# EAGLE design brushless_sub_driver_4 (EAGLE 9.6.2)
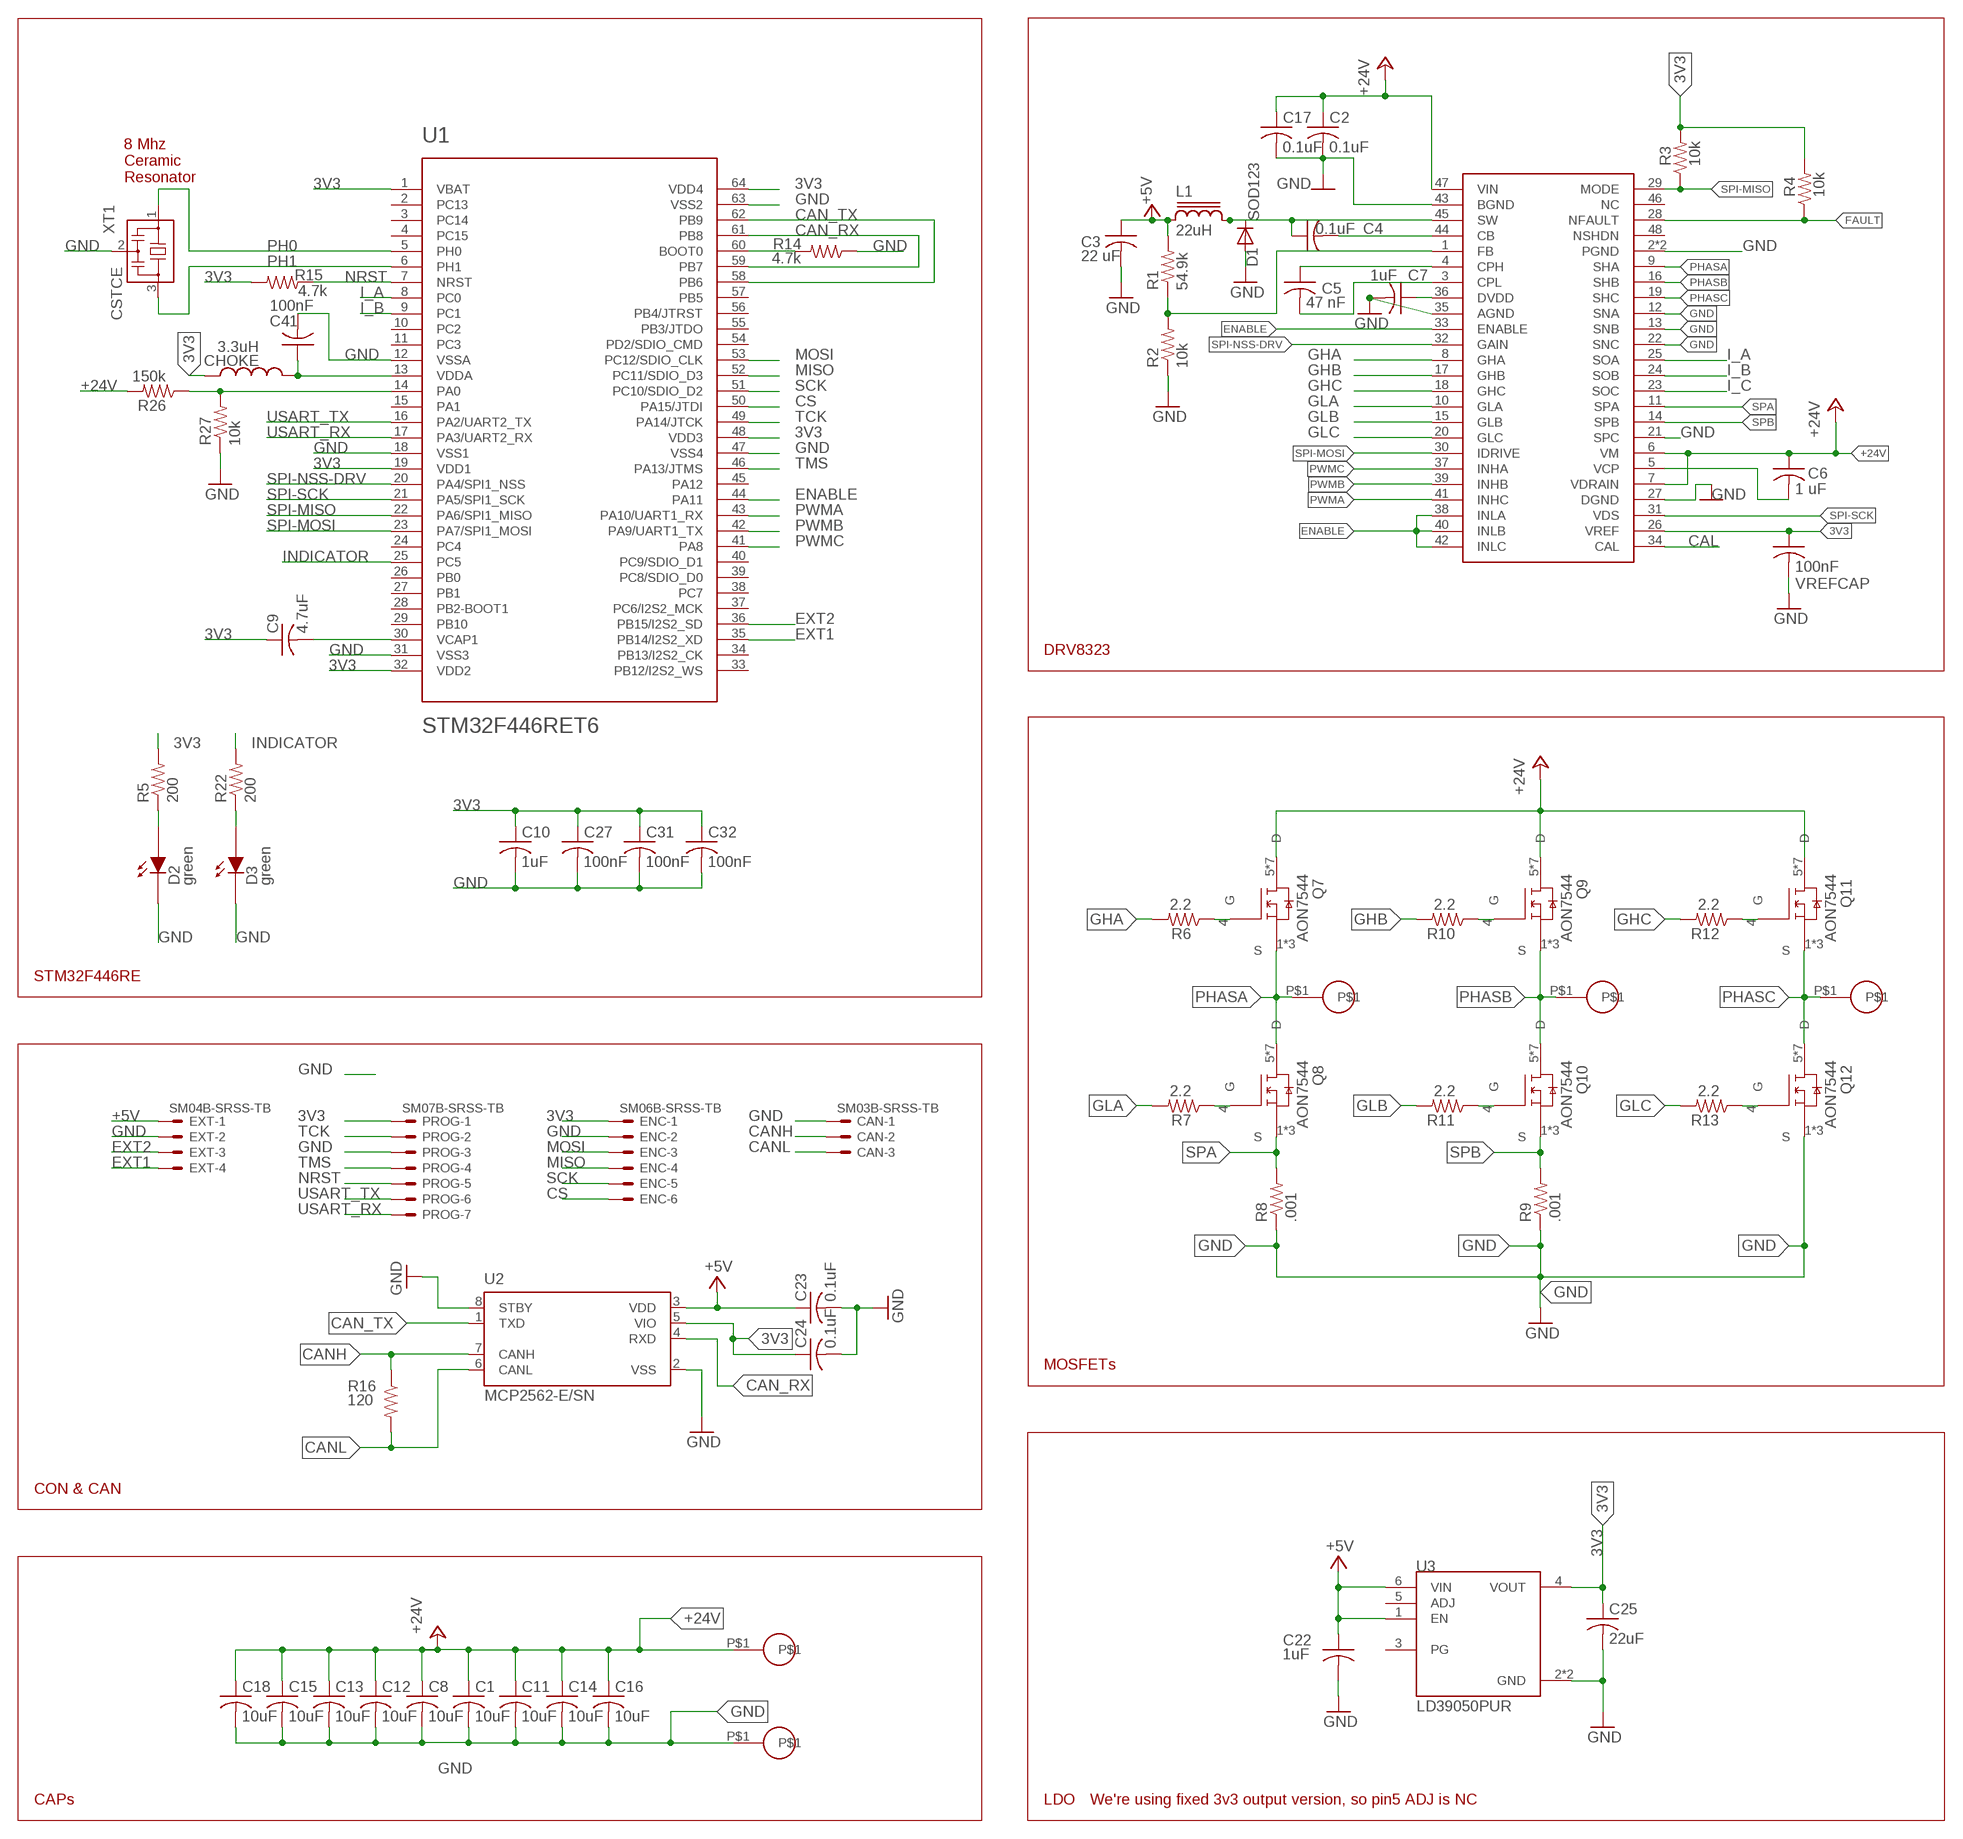
[diagram p0: schematic, sheet 1]

## Parts
C1  10uF  C-USC1206K  [C1206K]
C2  0.1uF  C-USC0603K  [C0603K]
C3  22 uF  C-USC0603K  [C0603K]
C4  0.1uF  C-USC0603K  [C0603K]
C5  47 nF  C-USC0402K  [C0402K]
C6  1 uF  C-USC0603K  [C0603K]
C7  1uF  C-USC0402K  [C0402K]
C8  10uF  C-USC1206K  [C1206K]
C9  4.7uF  C-USC0402K  [C0402K]
C10  1uF  C-USC0402K  [C0402K]
C11  10uF  C-USC1206K  [C1206K]
C12  10uF  C-USC1206K  [C1206K]
C13  10uF  C-USC1206K  [C1206K]
C14  10uF  C-USC1206K  [C1206K]
C15  10uF  C-USC1206K  [C1206K]
C16  10uF  C-USC1206K  [C1206K]
C17  0.1uF  C-USC1206K  [C1206K]
C18  10uF  C-USC1206K  [C1206K]
C22  1uF  C-USC0402  [C0402]
C23  0.1uF  C-USC0603K  [C0603K]
C24  0.1uF  C-USC0603K  [C0603K]
C25  22uF  C-USC0603K  [C0603K]
C27  100nF  C-USC0402K  [C0402K]
C31  100nF  C-USC0402K  [C0402K]
C32  100nF  C-USC0402K  [C0402K]
C41  100nF  C-USC0402  [C0402]
CAN  SM03B-SRSS-TB  [SM03B-SRSS-TB]
CHOKE  3.3uH  INDUCTOR0603  [0603]
D1  SOD123  DIODE-SOD123  [SOD123]
D2  green  LEDB  [0603P]
D3  green  LEDB  [0603P]
DRV1  DRV8323RH  [QFN50P700X700X90-49N]
ENC  SM06B-SRSS-TB  [SM06B-SRSS-TB]
EXT  SM04B-SRSS-TB  [SM04B-SRSS-TB]
L1  22uH  SDR0302  [SDR0302]
O_A  18_AWG_PAD  [18_AWG_PAD]
O_B  18_AWG_PAD  [18_AWG_PAD]
O_C  18_AWG_PAD  [18_AWG_PAD]
PROG  SM07B-SRSS-TB  [SM07B-SRSS-TB]
Q7  AON7544  [AON7544]
Q8  AON7544  [AON7544]
Q9  AON7544  [AON7544]
Q10  AON7544  [AON7544]
Q11  AON7544  [AON7544]
Q12  AON7544  [AON7544]
R1  54.9k  R-US_R0402  [R0402]
R2  10k  R-US_R0402  [R0402]
R3  10k  R-US_R0402  [R0402]
R4  10k  R-US_R0402  [R0402]
R5  200  R-US_R0402  [R0402]
R6  2.2  R-US_R0402  [R0402]
R7  2.2  R-US_R0402  [R0402]
R8  .001  R-US_R1210  [R1210]
R9  .001  R-US_R1210  [R1210]
R10  2.2  R-US_R0402  [R0402]
R11  2.2  R-US_R0402  [R0402]
R12  2.2  R-US_R0402  [R0402]
R13  2.2  R-US_R0402  [R0402]
R14  4.7k  R-US_R0402  [R0402]
R15  4.7k  R-US_R0402  [R0402]
R16  120  R-US_R0603  [R0603]
R22  200  R-US_R0402  [R0402]
R26  150k  R-US_R0402  [R0402]
R27  10k  R-US_R0402  [R0402]
U1  STM32F446RET6  [TQFP64]
U2  MCP2562-E/SN  [SOIC127P600X175-8N]
U3  LD39050PUR  [SON95P300X300X100-7N]
U$8  18_AWG_PAD  [18_AWG_PAD]
U$10  18_AWG_PAD  [18_AWG_PAD]
VREFCAP  100nF  C-USC0402K  [C0402K]
XT1  CSTCE  [CSTCE]

## Nets
3V3: C9.1 C10.1 C24.1 C25.1 C27.1 C31.1 C32.1 CHOKE.1 DRV1.26(VREF) ENC.1 PROG.1 R3.2 R4.2 R5.2 R15.2 U1.1(VBAT) U1.19(VDD1) U1.32(VDD2) U1.48(VDD3) U1.64(VDD4) U2.5(VIO) U3.4(VOUT) VREFCAP.1
+5V: C3.1 C22.1 C23.1 EXT.1 L1.1 R1.2 U2.3(VDD) U3.1(EN) U3.6(VIN)
+24V: C1.1 C2.1 C6.1 C8.1 C11.1 C12.1 C13.1 C14.1 C15.1 C16.1 C17.1 C18.1 DRV1.6(VM) DRV1.7(VDRAIN) DRV1.47(VIN) Q7.5(D) Q7.6(D) Q7.7(D) Q7.8(D) Q7.9(D) Q7.10(D) Q7.11(D) Q9.5(D) Q9.6(D) Q9.7(D) Q9.8(D) Q9.9(D) Q9.10(D) Q9.11(D) Q11.5(D) Q11.6(D) Q11.7(D) Q11.8(D) Q11.9(D) Q11.10(D) Q11.11(D) R26.2 U$8.P$1
BOOT: C4.2 DRV1.44(CB)
CAL: DRV1.34(CAL)
CAN_RX: U1.59(PB7) U1.61(PB8) U2.4(RXD)
CAN_TX: U1.58(PB6) U1.62(PB9) U2.1(TXD)
CANH: CAN.2 R16.1 U2.7(CANH)
CANL: CAN.3 R16.2 U2.6(CANL)
CPH: C5.1 DRV1.4(CPH)
CPL: C5.2 DRV1.3(CPL)
CS: ENC.6 U1.50(PA15/JTDI)
DEVICE3.3: C7.1 DRV1.36(DVDD)
ENABLE: DRV1.33(ENABLE) DRV1.38(INLA) DRV1.40(INLB) DRV1.42(INLC) U1.44(PA11)
EXT1: EXT.4 U1.35(PB14/I2S2_XD)
EXT2: EXT.3 U1.36(PB15/I2S2_SD)
FAULT: DRV1.28(NFAULT) R4.1
FB: DRV1.1(FB) R1.1 R2.2
GHA: DRV1.8(GHA) R6.2
GHB: DRV1.17(GHB) R10.2
GHC: DRV1.18(GHC) R12.2
GLA: DRV1.10(GLA) R7.2
GLB: DRV1.15(GLB) R11.2
GLC: DRV1.20(GLC) R13.2
GND: C1.2 C2.2 C3.2 C7.2 C8.2 C10.2 C11.2 C12.2 C13.2 C14.2 C15.2 C16.2 C17.2 C18.2 C22.2 C23.2 C24.2 C25.2 C27.2 C31.2 C32.2 C41.2 CAN.1 D1.A D2.2(D_OUT) D3.2(D_OUT) DRV1.2(PGND) DRV1.12(SNA) DRV1.13(SNB) DRV1.21(SPC) DRV1.22(SNC) DRV1.27(DGND) DRV1.35(AGND) DRV1.43(BGND) DRV1.49(PGND) ENC.2 EXT.2 PROG.3 Q12.1(S) Q12.2(S) Q12.3(S) R2.1 R8.1 R9.1 R14.1 R27.1 U1.12(VSSA) U1.18(VSS1) U1.31(VSS3) U1.47(VSS4) U1.63(VSS2) U2.2(VSS) U2.8(STBY) U3.2(GND) U3.7(GND) U$10.P$1 VREFCAP.2 XT1.2
I_A: DRV1.25(SOA) U1.8(PC0)
I_B: DRV1.24(SOB) U1.9(PC1)
I_C: DRV1.23(SOC)
INDICATOR: R22.2 U1.25(PC5)
MISO: ENC.4 U1.52(PC11/SDIO_D3)
MOSI: ENC.3 U1.53(PC12/SDIO_CLK)
N$1: D2.1(D_IN) R5.1
N$2: C41.1 CHOKE.2 U1.13(VDDA)
N$3: C9.2 U1.30(VCAP1)
N$5: Q7.4(G) R6.1
N$7: Q8.4(G) R7.1
N$8: Q9.4(G) R10.1
N$10: Q10.4(G) R11.1
N$11: Q11.4(G) R12.1
N$12: Q12.4(G) R13.1
N$14: R14.2 U1.60(BOOT0)
N$24: R26.1 R27.2 U1.14(PA0)
N$28: D3.1(D_IN) R22.1
NRST: PROG.5 R15.1 U1.7(NRST)
PH0: U1.5(PH0) XT1.1
PH1: U1.6(PH1) XT1.3
PHASA: DRV1.9(SHA) O_A.P$1 Q7.1(S) Q7.2(S) Q7.3(S) Q8.5(D) Q8.6(D) Q8.7(D) Q8.8(D) Q8.9(D) Q8.10(D) Q8.11(D)
PHASB: DRV1.16(SHB) O_B.P$1 Q9.1(S) Q9.2(S) Q9.3(S) Q10.5(D) Q10.6(D) Q10.7(D) Q10.8(D) Q10.9(D) Q10.10(D) Q10.11(D)
PHASC: DRV1.19(SHC) O_C.P$1 Q11.1(S) Q11.2(S) Q11.3(S) Q12.5(D) Q12.6(D) Q12.7(D) Q12.8(D) Q12.9(D) Q12.10(D) Q12.11(D)
PWMA: DRV1.41(INHC) U1.43(PA10/UART1_RX)
PWMB: DRV1.39(INHB) U1.42(PA9/UART1_TX)
PWMC: DRV1.37(INHA) U1.41(PA8)
SCK: ENC.5 U1.51(PC10/SDIO_D2)
SPA: DRV1.11(SPA) Q8.1(S) Q8.2(S) Q8.3(S) R8.2
SPB: DRV1.14(SPB) Q10.1(S) Q10.2(S) Q10.3(S) R9.2
SPI-MISO: DRV1.29(MODE) R3.1 U1.22(PA6/SPI1_MISO)
SPI-MOSI: DRV1.30(IDRIVE) U1.23(PA7/SPI1_MOSI)
SPI-NSS-DRV: DRV1.32(GAIN) U1.20(PA4/SPI1_NSS)
SPI-SCK: DRV1.31(VDS) U1.21(PA5/SPI1_SCK)
SW: C4.1 D1.C DRV1.45(SW) L1.2
TCK: PROG.2 U1.49(PA14/JTCK)
TMS: PROG.4 U1.46(PA13/JTMS)
USART_RX: PROG.7 U1.17(PA3/UART2_RX)
USART_TX: PROG.6 U1.16(PA2/UART2_TX)
VCP: C6.2 DRV1.5(VCP)
Unconnected: DRV1.46(NC) DRV1.48(NSHDN) U1.2(PC13) U1.3(PC14) U1.4(PC15) U1.10(PC2) U1.11(PC3) U1.15(PA1) U1.24(PC4) U1.26(PB0) U1.27(PB1) U1.28(PB2-BOOT1) U1.29(PB10) U1.33(PB12/I2S2_WS) U1.34(PB13/I2S2_CK) U1.37(PC6/I2S2_MCK) U1.38(PC7) U1.39(PC8/SDIO_D0) U1.40(PC9/SDIO_D1) U1.45(PA12) U1.54(PD2/SDIO_CMD) U1.55(PB3/JTDO) U1.56(PB4/JTRST) U1.57(PB5) U3.3(PG) U3.5(ADJ)

## Notes on the sheet
- 8 Mhz
  Ceramic
  Resonator
- DRV8323
- STM32F446RE
- MOSFETs
- CON & CAN
- CAPs | LDO | We're using fixed 3v3 output version, so pin5 ADJ is NC

## Library data of the parts
C1-C18 C22-C25 C27 C31 C32 C41 VREFCAP = rcl:C-US: CAPACITOR, American symbol
CAN = con-jst2:?M03B-SRSS-TB: Disconnectable Crimp style connector, 1.0mm pitch 3 contacts
CHOKE = SparkFun-Passives:INDUCTOR: Inductors Basic Inductor/Choke - 0603 and 1206. Footprints are not proven and vary greatly between part numbers. INDUCTOR POWER 3.3UH 4.0A SMD 0.197" L x 0.197" W x 0.177" H (5.00mm x 5.00mm x 4.50mm)
D1 = diode:DIODE-: DIODE
D2 D3 = m-pad-2.1:LED: LED's in various packages
DRV1 = BenLibrary:DRV8323RH
ENC = con-jst2:?M06B-SRSS-TB: Disconnectable Crimp style connector, 1.0mm pitch 6 contacts
EXT = con-jst2:?M04B-SRSS-TB: Disconnectable Crimp style connector, 1.0mm pitch 4 contacts
L1 = inductor-bourns:SDR0302: POWER INDUCTOR
O_A O_B O_C U$8 U$10 = BenLibrary:18_AWG_PAD
PROG = con-jst2:?M07B-SRSS-TB: Disconnectable Crimp style connector, 1.0mm pitch 7 contacts
Q7-Q12 = AON7544:AON7544: MOSFET N Trench 30V 30A(Tc) 2.2V @ 250uA 5 m @ 20A,10V DFN-8_3x3 EP RoHS Source: Datasheet <https://datasheet.lcsc.com/lcsc/1912111437_Alpha---Omega-Semicon-AON7544_C315567.pdf>; DESCRIPTION: MOSFET N Trench 30V 30A(Tc) 2.2V @ 250uA 5 m @ 20A,10V DFN-8_3x3 EP RoHS; HEIGHT: 0.9mm; MANUFACTURER_NAME: Alpha & Omega Semiconductors; MANUFACTURER_PART_NUMBER: AON7544
R1-R16 R22 R26 R27 = rcl:R-US_: RESISTOR, American symbol
U1 = BenLibrary:STM32F446RET6: ARM DSP Chip used on the WAV Trigger board.
U2 = MCP2562-E_SN:MCP2562-E/SN: MCP2562 Series 5 V Surface Mount High-Speed CAN Transceiver - SOIC-8 Check availability <https://pricing.snapeda.com/parts/MCP2562-E/SN/Microchip/view-part?ref=eda>; AVAILABILITY: In Stock; DESCRIPTION: 1/1 Transceiver Half CANbus 8-SOIC; MF: Microchip; MP: MCP2562-E/SN; PACKAGE: SO-8 Microchip; PRICE: None; PURCHASE-URL: https://pricing.snapeda.com/search/part/MCP2562-E/SN/?ref=eda
U3 = LD39050PUR:LD39050PUR: LD39050 Series Adj to 0.8 V 500 mA Low Noise Voltage Regulator - SOT-23-5 Check availability <https://pricing.snapeda.com/parts/LD39050PUR/STMicroelectronics/view-part?ref=eda>; AVAILABILITY: In Stock; DESCRIPTION: Linear Voltage Regulator IC Positive Adjustable 1 Output 500mA 6-DFN (3x3); MF: STMicroelectronics; MP: LD39050PUR; PACKAGE: DFN-6 STMicroelectronics; PRICE: None; PURCHASE-URL: https://pricing.snapeda.com/search/part/LD39050PUR/?ref=eda
XT1 = sc_usercreated:CSTCE

## Board
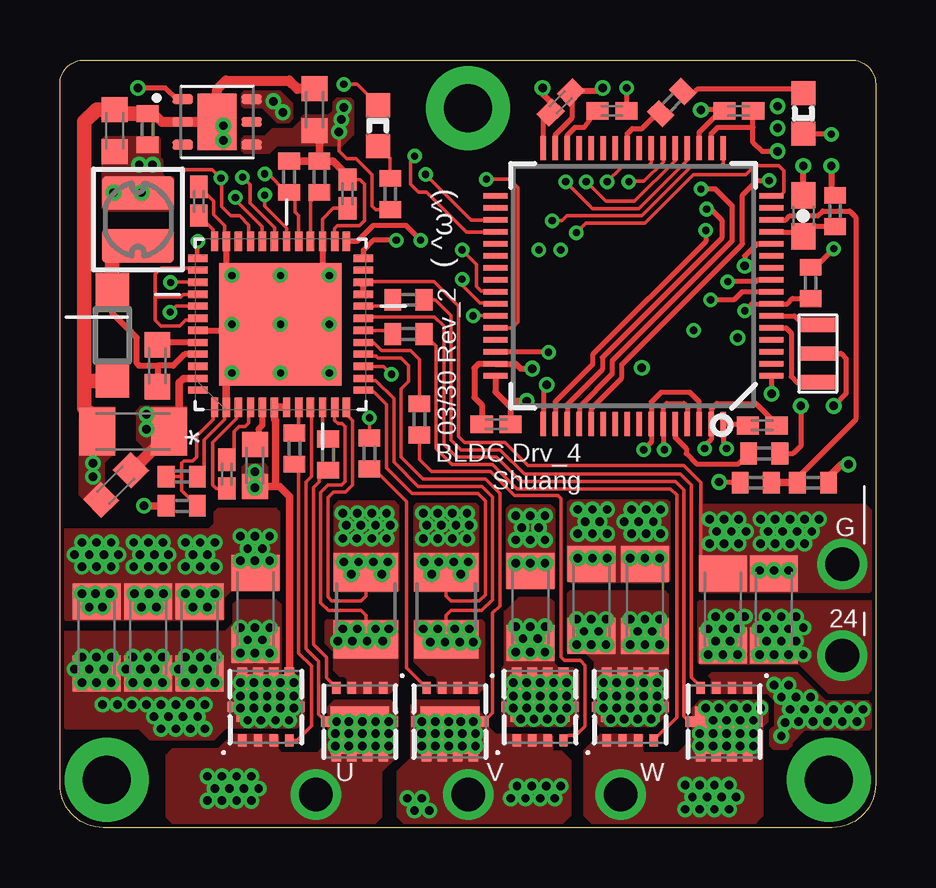
[diagram p1: board, top side]
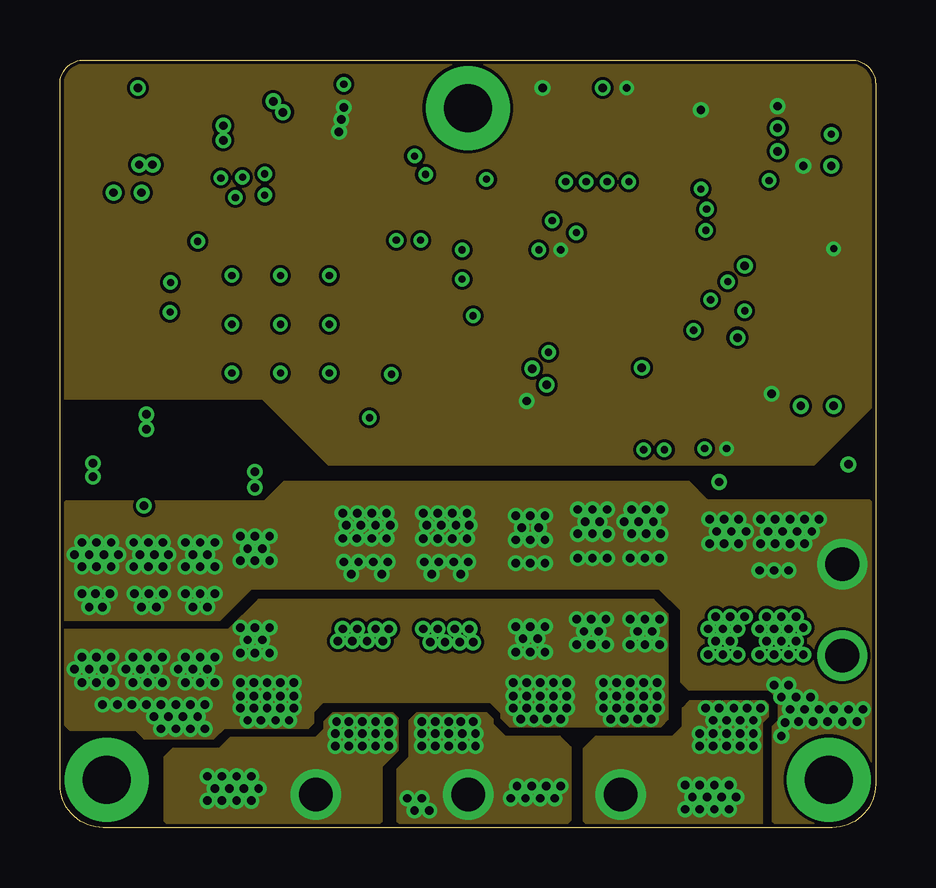
[diagram p2: board, inner layer Route2]
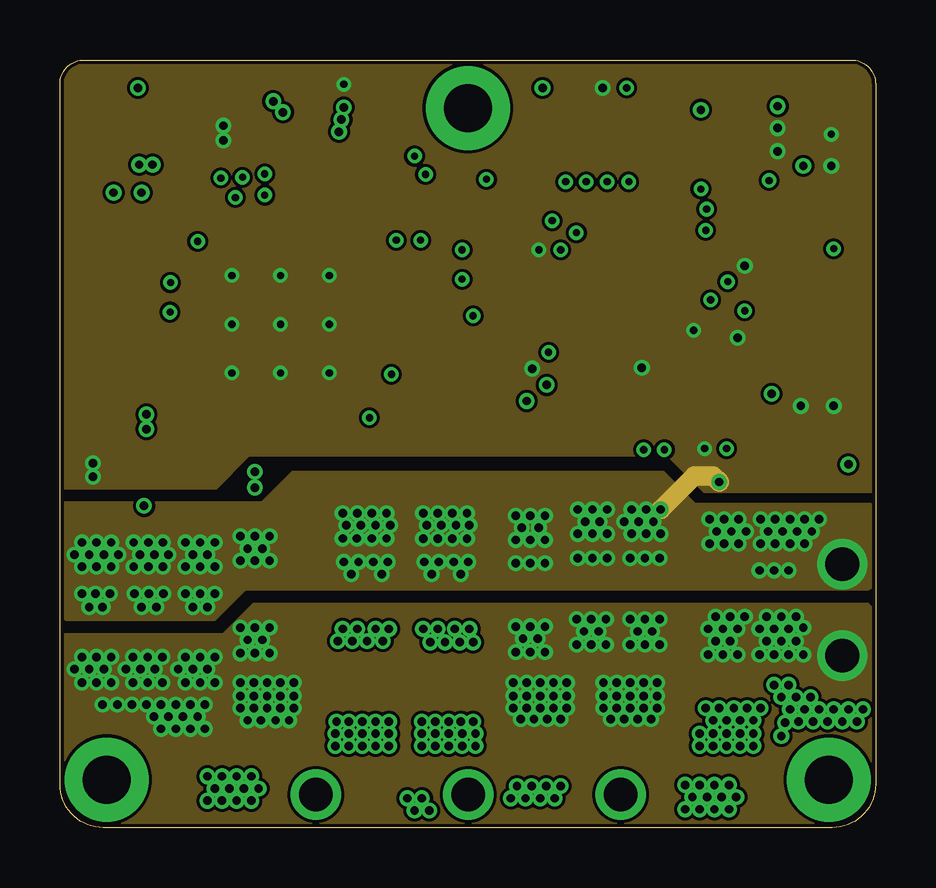
[diagram p3: board, inner layer Route15]
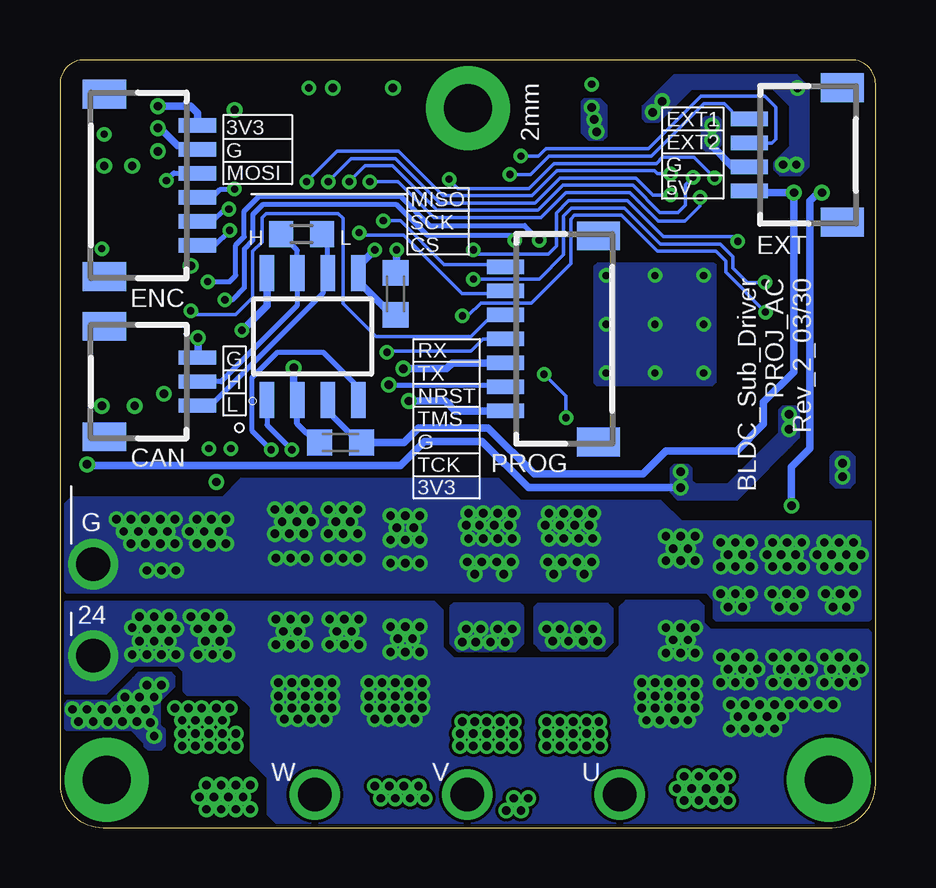
[diagram p4: board, bottom side, seen from below]

Size 34 x 32 mm. Coordinates in mm from the lower left corner, seen from the top.
Outline: 1,32 33,32 arc-90 34,31 34,1.8 arc-90 32.2,0 1.8,0 arc-90 0,1.8 0,31 arc-90 1,32
Copper layers (1+2*15+16): Top 0.035mm / dielectric 1.5mm / Route2 0.035mm / dielectric 0.15mm / Route15 0.035mm / dielectric 0.2mm / Bottom 0.035mm
Design rules "shuang_4layer_jlc_t1 *": minimum track width 5mil, minimum drill 0.3mm, track to track 5mil, track to pad 5mil, pad to pad 5mil, via to via 6mil, smd to smd 5mil, copper to edge 6mil, drill to drill 6mil, minimum pad ring 10mil, minimum via ring 6mil, stop-mask expansion 4mil, vias tented up to drill 14mil, thermal gap 10mil

### Footprints (pad centres in the part's own frame; a part is rotated, then mirrored left to right if it is on the bottom)
C1206K = smd 1.5 x 2: 1 -1.5,0; 2 1.5,0
C0603K = smd 1.05 x 1.08: 1 -0.875,0; 2 0.875,0
C0402K = smd 0.925 x 0.74: 1 -0.6,0; 2 0.6,0
C0402 = smd 0.7 x 0.9: 1 -0.65,0; 2 0.65,0
SM03B-SRSS-TB = smd 0.6 x 1.55: 1 -1,2.975; 2 0,2.975; 3 1,2.975 | smd 1.2 x 1.8: FIT@1 -2.3,-0.9; FIT@2 2.3,-0.9
0603 = smd 1.1 x 1: 1 -0.85,0; 2 0.85,0
SOD123 = smd 1.4 x 1.4: A 1.9,0; C -1.9,0
0603P = smd 1 x 1: 1 -0.85,0; 2 0.85,0
QFN50P700X700X90-49N = smd 0.813 x 0.305: 1 -3.454,2.743; 2 -3.454,2.261; 3 -3.454,1.753; 4 -3.454,1.245; 5 -3.454,0.762; 6 -3.454,0.254; 7 -3.454,-0.254; 8 -3.454,-0.762; 9 -3.454,-1.245; 10 -3.454,-1.753; 11 -3.454,-2.261; 12 -3.454,-2.743; 25 3.454,-2.743; 26 3.454,-2.261; 27 3.454,-1.753; 28 3.454,-1.245; 29 3.454,-0.762; 30 3.454,-0.254; 31 3.454,0.254; 32 3.454,0.762; 33 3.454,1.245; 34 3.454,1.753; 35 3.454,2.261; 36 3.454,2.743 | smd 0.305 x 0.813: 13 -2.743,-3.454; 14 -2.261,-3.454; 15 -1.753,-3.454; 16 -1.245,-3.454; 17 -0.762,-3.454; 18 -0.254,-3.454; 19 0.254,-3.454; 20 0.762,-3.454; 21 1.245,-3.454; 22 1.753,-3.454; 23 2.261,-3.454; 24 2.743,-3.454; 37 2.743,3.454; 38 2.261,3.454; 39 1.753,3.454; 40 1.245,3.454; 41 0.762,3.454; 42 0.254,3.454; 43 -0.254,3.454; 44 -0.762,3.454; 45 -1.245,3.454; 46 -1.753,3.454; 47 -2.261,3.454; 48 -2.743,3.454 | smd 5.105 x 5.105: 49 0,0
SM06B-SRSS-TB = smd 0.6 x 1.55: 1 -2.5,2.975; 2 -1.5,2.975; 3 -0.5,2.975; 4 0.5,2.975; 5 1.5,2.975; 6 2.5,2.975 | smd 1.2 x 1.8: FIT@1 -3.8,-0.9; FIT@2 3.8,-0.9
SM04B-SRSS-TB = smd 0.6 x 1.55: 1 -1.5,2.975; 2 -0.5,2.975; 3 0.5,2.975; 4 1.5,2.975 | smd 1.2 x 1.8: FIT@1 -2.8,-0.9; FIT@2 2.8,-0.9
SDR0302 = smd 3 x 1.4: 1 0,1.1; 2 0,-1.1
18_AWG_PAD = drill 1.4: P$1 0,0
SM07B-SRSS-TB = smd 0.6 x 1.55: 1 -3,2.975; 2 -2,2.975; 3 -1,2.975; 4 0,2.975; 5 1,2.975; 6 2,2.975; 7 3,2.975 | smd 1.2 x 1.8: FIT@1 -4.3,-0.9; FIT@2 4.3,-0.9
AON7544 = smd 0.35 x 0.5: 1 -0.975,-1.4; 2 -0.325,-1.4; 3 0.325,-1.4; 4 0.975,-1.4 | smd 0.4 x 0.3: 5 0.975,1.5; 6 0.325,1.5; 7 -0.325,1.5; 8 -0.975,1.5 | smd 0.38 x 0.43: 9 -1.415,0; 11 1.415,0 | smd 2.45 x 1.98: 10 0,0.36
R0402 = smd 0.7 x 0.9: 1 -0.65,0; 2 0.65,0
R1210 = smd 1.6 x 2.7: 1 -1.4,0; 2 1.4,0
R0603 = smd 1 x 1.1: 1 -0.85,0; 2 0.85,0
TQFP64 = smd 0.22 x 1: 1 -3.75,-5.75; 2 -3.25,-5.75; 3 -2.75,-5.75; 4 -2.25,-5.75; 5 -1.75,-5.75; 6 -1.25,-5.75; 7 -0.75,-5.75; 8 -0.25,-5.75; 9 0.25,-5.75; 10 0.75,-5.75; 11 1.25,-5.75; 12 1.75,-5.75; 13 2.25,-5.75; 14 2.75,-5.75; 15 3.25,-5.75; 16 3.75,-5.75; 33 3.75,5.75; 34 3.25,5.75; 35 2.75,5.75; 36 2.25,5.75; 37 1.75,5.75; 38 1.25,5.75; 39 0.75,5.75; 40 0.25,5.75; 41 -0.25,5.75; 42 -0.75,5.75; 43 -1.25,5.75; 44 -1.75,5.75; 45 -2.25,5.75; 46 -2.75,5.75; 47 -3.25,5.75; 48 -3.75,5.75 | smd 1 x 0.22: 17 5.75,-3.75; 18 5.75,-3.25; 19 5.75,-2.75; 20 5.75,-2.25; 21 5.75,-1.75; 22 5.75,-1.25; 23 5.75,-0.75; 24 5.75,-0.25; 25 5.75,0.25; 26 5.75,0.75; 27 5.75,1.25; 28 5.75,1.75; 29 5.75,2.25; 30 5.75,2.75; 31 5.75,3.25; 32 5.75,3.75; 49 -5.75,3.75; 50 -5.75,3.25; 51 -5.75,2.75; 52 -5.75,2.25; 53 -5.75,1.75; 54 -5.75,1.25; 55 -5.75,0.75; 56 -5.75,0.25; 57 -5.75,-0.25; 58 -5.75,-0.75; 59 -5.75,-1.25; 60 -5.75,-1.75; 61 -5.75,-2.25; 62 -5.75,-2.75; 63 -5.75,-3.25; 64 -5.75,-3.75
SOIC127P600X175-8N = smd 1.5 x 0.6: 1 -2.65,1.905; 2 -2.65,0.635; 3 -2.65,-0.635; 4 -2.65,-1.905; 5 2.65,-1.905; 6 2.65,-0.635; 7 2.65,0.635; 8 2.65,1.905
SON95P300X300X100-7N = smd 0.84 x 0.4: 1 -1.435,0.95; 2 -1.435,0; 3 -1.435,-0.95; 4 1.435,-0.95; 5 1.435,0; 6 1.435,0.95 | smd 1.625 x 2.365: 7 0,0
CSTCE = smd 0.6 x 1.6: 1 -1.2,0; 2 0,0; 3 1.2,0

### Placement (x,y rotation side)
C1  3.68,7.92 90 top
C2  2.34,14.27 225 top
C3  2.29,29.06 90 top
C4  4.06,19.25 90 top
C5  6.96,14.73 270 top
C6  8.13,15.09 90 top
C7  5.79,26.11 90 top
C8  5.82,7.92 90 top
C9  23.01,29.87 180 top
C10  29.27,16.76 0 top
C11  8.15,9.12 90 top
C12  1.52,7.92 90 top
C13  27.64,9.09 90 top
C14  24.38,9.5 90 top
C15  22.15,9.5 90 top
C16  19.61,9.19 90 top
C17  3.05,16.51 180 top
C18  29.77,9.09 90 top
C22  3.66,29.11 90 top
C23  22.3,16.05 180 bottom
C24  20.02,22.25 90 bottom
C25  10.62,29.92 90 top
C27  28.3,29.87 0 top
C31  18.19,16.81 180 top
C32  20.88,30.23 45 top
C41  32.31,25.7 90 top
CAN  31.24,18.59 270 bottom
CHOKE  30.99,25.5 270 top
D1  2.18,20.52 270 top
D2  13.26,29.26 90 top
D3  30.99,29.77 270 top
DRV1  9.19,20.98 90 top
ENC  31.24,26.77 270 bottom
EXT  2.29,28.04 90 bottom
L1  3.25,25.35 0 top
O_A  10.67,1.37 0 top
O_B  17.02,1.37 0 top
O_C  23.37,1.37 0 top
PROG  12.45,20.37 90 bottom
Q7  8.59,5.03 0 top
Q8  12.5,4.42 180 top
Q9  20.02,5.03 0 top
Q10  16.26,4.42 180 top
Q11  23.77,5.03 0 top
Q12  27.69,4.42 180 top
R1  5.08,13.41 180 top
R2  5.08,14.63 180 top
R3  9.55,27.13 90 top
R4  10.82,27.13 90 top
R5  13.77,26.42 270 top
R6  9.78,15.8 90 top
R7  11.18,15.54 90 top
R8  12.75,9.25 270 top
R9  16.1,9.25 270 top
R10  14.99,17.02 90 top
R11  12.9,15.6 90 top
R12  14.53,20.57 180 top
R13  14.53,22 180 top
R14  29.36,15.6 180 top
R15  31.29,22.71 90 top
R16  23.93,24.74 0 bottom
R22  25.5,30.23 225 top
R26  31.39,14.38 0 top
R27  29.01,14.38 0 top
U1  23.9,22.58 90 top
U2  23.47,20.47 90 bottom
U3  6.55,29.41 0 top
U$8  32.61,7.16 0 top
U$10  32.61,10.97 0 top
VREFCAP  11.99,26.42 270 top
XT1  31.6,19.76 90 top

### Tracks (layer width: path | path; a pad name or v marks a point on that pad's centre or on a via)
3V3  (via drill 0.3, 0.35)
  Top 0.152: VREFCAP.1 12.51,27.02 12.7,26.82 12.7,25.3 12.5,25.09 11.58,25.09 11.46,24.97 DRV1.26 | R5.2 13.15,25.77 13.01,25.91 13.01,27.23 12.34,27.89 11.94,27.89 11.63,28.19 v11.63,29.01
  Top 0.203: C10.1 28.61,16.83 U1.64 27.65,15.94 v27.79,15.8 | R15.2 31.49,23.36 v32.26,24.13 | U1.1 29.65,18.1 v29.67,18.09 | U1.32 20.15,29.5 C32.1 | v23.62,30.84 23.61,30.83 C9.1 | v26.72,29.92 27.63,29.92 C27.1 27.48,29.82 26.65,28.99 U1.19
  Top 0.254: U1.48 18.15,18.16 18.79,17.53 | 18.79,17.53 C31.1 | CHOKE.1 v30.99,27.58 | v19.46,17.78 19.04,17.78 18.79,17.53 | C32.1 20.45,30.26 20.12,30.6 v20.12,30.84
  Top 0.305: R4.2 R3.2 | VREFCAP.1 11.99,27.17 11.38,27.78 R4.2 | C25.1 10.82,28.84 R4.2
  Bottom 0.305: v29.92,30.07 28.56,30.07 28.27,29.78 ENC.1 | PROG.1 17.52,17.37 17.93,17.78 v19.46,17.78 | C24.1 20.17,21.38 21.57,22.77 U2.5 21.57,23.39 v20.88,24.08
  other vias: 11.73,29.51 11.84,30.02
  pour Route2 (no thermals): 0,17.88 8.43,17.88 11.18,15.14 31.45,15.14 33.99,17.68 33.99,31.5 33.48,32 0.36,32 0,31.65
  pour Top (no thermals): 7.67,28.14 8.74,28.14 9.04,28.45 11.79,28.45 12.24,28.91 12.24,30.28 12.14,30.38 11.53,30.38 11.38,30.23 11.38,29.87 11.18,29.67 10.16,29.67 10.06,29.57 10.06,29.46 9.7,29.11 8.84,29.11 8.53,28.8 7.67,28.8 7.57,28.7 7.57,28.24
  pour Bottom (no thermals): 11.23,30.12 11.23,28.8 11.38,28.65 11.94,28.65 12.24,28.96 12.24,30.28 12.14,30.38 11.48,30.38
+5V  (via drill 0.35)
  Top 0.203: U3.1 4.86,30.36 4.39,30.83 v3.25,30.83 v3.25,30.84
  Top 0.305: R1.2 v3.5,13.41
  Top 0.508: v2.23,26.47 2.25,26.45 L1.1 3.27,26.47 v3.4,26.47
  Bottom 0.254: C23.1 21.53,16.05 22.84,17.36 U2.3
  Bottom 0.305: v3.5,13.41 3.5,15.04 2.74,15.8 2.74,26.11 2.39,26.47 v2.23,26.47 | C23.1 19.66,16.05 19.05,16.66 16.15,16.66 14.22,14.73 9.7,14.73 8.74,15.7 5.79,15.7 4.67,16.82 4.67,17.73 3.4,19 v3.4,26.47 5.19,26.47 EXT.1
  other vias: 3.3,27.64 3.86,27.64 8.89,30.28 9.3,29.82
  pour Top (no thermals): 1.78,25.81 1.78,28.7 1.88,28.8 4.06,28.8 4.17,28.7 4.17,27.94 4.27,27.84 4.27,27.23 4.37,27.13 4.67,27.13 4.72,27.08 4.72,25.81 4.62,25.7 1.88,25.7
  pour Top (no thermals): 7.57,30.58 7.57,30.12 7.67,30.02 8.43,30.02 9.04,29.41 9.55,29.41 9.7,29.57 9.7,30.18 9.19,30.68 7.67,30.68
  pour Bottom (no thermals): 4.27,30.78 7.67,30.78 9.04,29.41 9.55,29.41 9.7,29.57 9.7,30.07 8.38,31.39 3.3,31.39 2.79,30.89 2.79,27.53 3.15,27.18 3.96,27.18 4.22,27.43 4.22,27.74 3.56,28.4 3.56,30.07
+24V  (via drill 0.35)
  Top 0.203: Q7.5 9.75,6.34 v9.75,6.04
  Top 0.305: DRV1.7 DRV1.6 8.94,17.02 8.99,16.97 8.99,14.21 | 8.99,14.21 9.15,14.21 9.57,13.8 Q7.5 | DRV1.47 5.16,18.72 4.98,18.54 4.98,16.94 C17.1 | v8.13,14.83 C6.1 8.99,14.21 | v32.87,15.14 32.56,15.14 32.04,14.62 R26.2
  Top 0.508: C17.1 4.55,16.43 3.01,14.89 C2.1
  Bottom 0.305: v32.87,15.14 32.82,15.09 19.81,15.09 18.8,16.1 16.41,16.1 14.48,14.17 v8.13,14.17
  other vias: 7.52,6.05 8.08,6.05 8.64,6.05 9.19,6.05 7.52,5.49 8.08,5.49 8.64,5.49 7.52,4.98 8.08,4.98 9.19,5.49 9.75,5.49 3.61,17.22 3.61,16.61 0.91,6.05 1.52,6.05 2.13,6.05 1.22,6.6 1.83,6.6 0.91,7.11 1.52,7.11 2.13,7.11 8.64,4.98 9.19,4.98 9.75,4.98 7.82,4.47 8.38,4.47 8.99,4.47 9.55,4.47 30.68,7.77 27.33,8.79 27.94,8.79 28.55,8.79 29.46,8.79 30.07,8.79 30.68,8.79 30.99,8.33 30.99,7.21 3,5.13 3.61,5.13 4.22,5.13 4.83,5.13 5.44,5.13 6.05,5.13 3.91,4.62 4.52,4.62 5.13,4.62 5.74,4.62 4.22,4.11 4.83,4.11 5.44,4.11 6.05,4.11 3.05,6.05 3.66,6.05 4.27,6.05 3.35,6.6 3.96,6.6 3.05,7.11 3.66,7.11 4.27,7.11 5.23,6.05 5.84,6.05 6.45,6.05 5.54,6.6 6.15,6.6 5.23,7.11 5.84,7.11 6.45,7.11 7.52,7.26 8.13,7.26 8.74,7.26 7.82,7.82 8.43,7.82 7.52,8.33 8.13,8.33 8.74,8.33 19,7.32 19.61,7.32 20.22,7.32 19.3,7.87 19.91,7.87 19,8.38 19.61,8.38 20.22,8.38 21.54,7.62 22.15,7.62 22.76,7.62 21.84,8.18 22.45,8.18 21.54,8.69 22.15,8.69 22.76,8.69 23.77,7.62 24.38,7.62 24.99,7.62 24.08,8.18 24.69,8.18 23.77,8.69 24.38,8.69 24.99,8.69 18.9,6.05 19.46,6.05 20.02,6.05 20.57,6.05 18.9,5.49 19.46,5.49 20.02,5.49 21.13,6.05 18.9,4.98 19.46,4.98 20.57,5.49 21.13,5.49 20.02,4.98 20.57,4.98 21.13,4.98 19.2,4.52 19.76,4.52 20.32,4.52 20.88,4.52 22.66,6.05 23.22,6.05 23.77,6.05 24.33,6.05 22.66,5.49 23.22,5.49 23.77,5.49 24.89,6.05 22.66,4.98 23.22,4.98 24.33,5.49 24.89,5.49 23.77,4.98 24.33,4.98 24.89,4.98 22.96,4.52 23.52,4.52 24.08,4.52 24.64,4.52 27.03,7.21 27.64,7.21 28.24,7.21 27.33,7.77 27.94,7.77 27.03,8.28 27.64,8.28 28.24,8.28 29.16,7.21 29.77,7.21 30.38,7.21 29.46,7.77 30.07,7.77 29.16,8.28 29.77,8.28 30.38,8.28 2.39,5.13 1.78,5.13 0.61,6.6 2.74,6.6 4.93,6.6
  pour Top (no thermals): 5.28,17.53 3.35,17.53 3.2,17.37 3.2,16.15 3.81,15.54 5.23,15.54 5.28,15.6
  pour Top (no thermals): 7.62,13.72 7.62,15.04 7.73,15.15 8.52,15.15 8.64,15.04 8.64,13.72
  pour Bottom (no thermals): 3.2,17.42 3.2,16.26 5.79,13.67 8.23,13.67 8.53,13.97 8.53,14.99 8.38,15.14 7.82,15.14 7.67,14.99 7.67,14.48 7.52,14.33 6.15,14.33 4.01,16.46 4.01,17.42 3.86,17.58 3.35,17.58
  pour Top (no thermals): 0.05,4.32 0.05,8.08 0.15,8.18 6.91,8.18 7.24,8.51 7.24,9.32 7.42,9.5 8.99,9.5 9.19,9.3 9.19,6.3 9.25,6.25 9.65,6.25 9.75,6.35 10.01,6.35 10.16,6.2 10.16,4.47 9.86,4.17 6.91,4.17 6.4,3.66 3.76,3.66 3.3,4.11 0.25,4.11
  pour Top (no thermals): 18.54,8.99 19.15,9.6 20.37,9.6 20.57,9.4 20.57,6.86 20.78,6.65 21.39,6.65 21.59,6.45 21.59,4.52 21.29,4.22 18.54,4.22 18.44,4.32 18.44,6.65 18.54,6.76
  pour Top (no thermals): 21.95,7.26 21.23,7.26 21.18,7.32 21.18,9.75 21.29,9.86 25.2,9.86 25.35,9.7 25.35,4.78 24.79,4.22 22.56,4.22 22.3,4.47 22.3,6.91
  pour Top (no thermals): 26.62,6.91 26.62,9.4 26.67,9.45 33.78,9.45 33.93,9.3 33.93,5.84 33.68,5.59 32.05,5.59 30.84,6.81 26.72,6.81
  pour Route15 (no thermals): 0.05,7.92 0.2,8.08 6.81,8.08 8.08,9.35 33.68,9.35 33.93,9.09 33.93,0.41 33.58,0.05 0.3,0.05 0.05,0.3
  pour Route2: 0.15,8.23 0.05,8.13 0.05,4.42 0.41,4.06 3.15,4.06 3.51,3.71 6.4,3.71 6.86,4.17 10.36,4.17 10.57,4.37 10.57,4.83 10.97,5.23 17.93,5.23 18.39,4.78 18.39,4.57 18.75,4.22 25.04,4.22 25.35,4.52 25.35,8.89 24.74,9.5 8.28,9.5 7.01,8.23
  pour Bottom (no thermals): 33.78,9.4 33.99,9.19 33.99,5.79 33.78,5.59 32.05,5.59 30.89,6.76 29.11,6.76 28.85,6.5 28.85,5.69 28.7,5.54 26.57,5.54 26.06,5.03 26.06,2.79 25.35,2.08 25.35,0.56 24.84,0.05 0.36,0.05 0.1,0.3 0.1,8.03 0.3,8.23 6.86,8.23 7.16,8.53 7.16,9.25 7.37,9.45 10.41,9.45 10.67,9.19 10.67,7.57 11.18,7.06 17.58,7.06 18.03,7.52 18.03,9.04 18.39,9.4
BOOT
  Top 0.254: DRV1.44 4.15,20.22 C4.2
CAN_RX  (via drill 0.3)
  Top 0.203: U1.61 26.15,17.54 26.01,17.68 25.3,17.68 25.15,17.53 U1.59 25.15,15.79 v25.2,15.75
  Bottom 0.203: U2.4 21.57,18.36 23.01,19.81 24.94,19.81 26.01,18.75 26.01,16.56 v25.2,15.75
CAN_TX  (via drill 0.3)
  Top 0.203: U1.62 26.65,17.75 26.26,18.14 25.04,18.14 24.65,17.74 U1.58 24.65,16.07 v24.33,15.75
  Bottom 0.203: U2.1 25.38,16.79 v24.33,15.75
CANH
  Bottom 0.203: CAN.2 27.28,18.59 24.11,21.77 U2.7 24.11,24.07 R16.1
CANL
  Bottom 0.203: CAN.3 27.72,17.59 23.04,22.28 23.04,22.92 U2.6 22.84,24.5 R16.2
CPH
  Top 0.152: C5.1 7.25,15.62 7.25,16.5 7.46,16.72 7.72,16.72 7.87,16.87 7.87,17.45 DRV1.4
CPL
  Top 0.152: C5.2 6.5,14.13 6.36,14.27 6.36,16.05 7.37,17.05 7.37,17.45 DRV1.3
CS  (via drill 0.3)
  Top 0.203: v26.92,24.89 26.92,24.43 22.2,19.71 22.2,19.29 20.66,17.75 U1.50
  Bottom 0.203: ENC.6 27.54,24.27 v26.92,24.89
DEVICE3.3
  Top 0.152: DRV1.36 6.38,24.51 6.38,24.93 C7.1
ENABLE  (via drill 0.3)
  Top 0.152: DRV1.33 7.87,24.51 7.87,25.12 7.5,25.5 7.11,25.5 6.73,25.88 6.73,27.05 v6.71,27.08 6.35,27.43 5.23,27.43 5.08,27.28 5.08,23.32 | DRV1.40 5.13,22.23 5.03,22.12 3.96,22.12 | DRV1.42 5.66,21.16 5.25,21.16 4.99,20.9 4.22,20.9 3.96,21.16 3.96,22.12 | 3.96,22.12 3.96,23.06 4.22,23.32 5.08,23.32 | DRV1.38 5.66,23.32 5.08,23.32 | v17.78,27.03 18.75,27.03 19.1,26.67 19.1,21.08 18.85,20.83 U1.44
  Bottom 0.152: v6.71,27.08 7.57,27.94 8.89,27.94 9.14,27.69 13.41,27.69 14.45,26.64 17.4,26.64 v17.78,27.03
EXT1  (via drill 0.3)
  Top 0.152: U1.35 17.14,25.33 v15.24,27.23
  Bottom 0.152: EXT.4 5.67,29.54 6.3,30.18 7.16,30.18 9.35,27.99 13.61,27.99 14.38,27.23 v15.24,27.23
EXT2  (via drill 0.3)
  Top 0.152: U1.36 16.95,24.83 15.29,26.5 14.94,26.5 14.61,26.83 14.61,27.73 14.78,27.91 v14.78,27.99
  Bottom 0.152: EXT.3 4.33,28.54 4.17,28.7 4.17,30.02 4.62,30.48 7.29,30.48 9.47,28.3 13.74,28.3 14.04,27.99 v14.78,27.99
FAULT
  Top 0.152: R4.1 10.44,26.1 DRV1.28
FB
  Top 0.152: DRV1.1 6.38,17.45 6.38,17.01 5.69,16.33 5.69,15.44 5.54,15.29 5.18,15.29 5.08,15.19 5.08,14.63 | R1.1 5.08,14.06 5.08,14.63 | R2.2 5.08,14.63
GHA
  Top 0.152: R6.2 9.78,16.54 9.96,16.71 DRV1.8
GHB
  Top 0.152: DRV1.17 13.07,20.22 13.4,19.89 14.61,19.89 14.99,19.51 R10.2
GHC
  Top 0.152: DRV1.18 13.73,20.73 R12.2
GLA
  Top 0.152: DRV1.10 10.95,16.42 R7.2
GLB  (via drill 0.3)
  Top 0.152: v12.9,17.08 R11.2 | v13.82,18.9 13.49,19.23 DRV1.15
  Bottom 0.152: v13.82,18.9 12.9,17.98 v12.9,17.08
GLC
  Top 0.152: DRV1.20 13.62,21.74 R13.2
GND  (via drill 0.3, 0.35)
  Top 0.152: R8.1 12.75,9.66 12.54,9.45 11.33,9.45 11.18,9.61 11.18,13.77 11.4,13.99 11.91,13.99 12.19,14.28 12.19,16.97 11.94,17.22 DRV1.12 | R9.1 16.1,9.65 16.31,9.45 17.48,9.45 17.73,9.7 17.73,13.61 17.42,13.92 14.68,13.92 13.61,14.99 13.61,17.63 13.01,18.24 DRV1.13 | DRV1.22 12.68,22.76 15.6,22.76 16.61,21.74 16.61,16.31 16.87,16.05 18.54,16.05 19.51,15.09 26.01,15.09 26.72,14.38 26.72,11 27.13,10.59 C13.2 | R2.1 5.73,14.73 6,15.01 6,16.16 6.86,17.02 6.86,17.45 DRV1.2 | DRV1.27 10.95,25.38 11.39,25.82 VREFCAP.2 | DRV1.35 6.86,24.51 6.86,25.09 6.4,25.55 6.4,26.11 C7.2 | v11.84,30.99 12.38,30.99 D2.2 | 32.14,28.92 v32.16,28.91
  Top 0.203: C10.2 29.87,16.82 29.01,17.68 27.38,17.68 27.15,17.45 U1.63 27.15,16.18 26.87,15.9 v26.87,15.8 | v30.89,17.58 30.89,15.91 30.57,15.6 R14.1 | XT1.2 32.56,19.76 32.77,19.56 32.77,18.09 v32.26,17.58 | U1.12 29.05,24.33 28.55,23.82 v28.55,23.42 | U1.31 20.65,28.88 21.34,29.57 21.34,30.61 C32.2 | U1.18 27.15,28.93 27.42,29.2 28.9,29.2 | 28.9,29.2 28.9,28.56 29.26,28.19 v29.92,28.19 | 28.9,29.2 C27.2 | R27.1 27.51,14.38 v27.48,14.4 | D3.2 32.14,28.92
  Top 0.254: DRV1.21 DRV1.22 | C31.2 17.59,17.62 17.27,17.93 17.27,19.15 17.45,19.33 U1.47 19,19.33 19.2,19.13 v19.68,19.13 | DRV1.43 6.91,20.73 v7.16,20.98 | DRV1.35 6.93,23.24 v7.16,23.01 | DRV1.27 10.95,23.29 v11.23,23.01 | v32.16,27.58 32.16,26.51 C41.2 | C32.2 21.35,30.7 22.46,30.7 v22.63,30.84
  Top 0.305: DRV1.2 6.93,18.72 v7.16,18.95
  Top 0.406: C22.2 3.91,29.76 4.26,29.41 U3.2 U3.7 6.55,30.79 6.91,31.14 9.56,31.14 9.91,30.8 C25.2
  Top 0.61: C22.2 2.46,29.76 C3.2 1.52,29.93 1.02,29.43 1.02,18.64 | C17.2 1.55,16.97 1.02,17.5 1.02,18.64 | D1.A 1.04,18.62 1.02,18.64
  Route15 0.813: v27.48,14.4 27.23,14.66 26.44,14.66 v25.04,13.26
  Bottom 0.203: CAN.1 28.25,19.61
  Bottom 0.254: C23.2 23.33,16.05 24.11,16.83 U2.2
  Bottom 0.305: PROG.3 17.64,19.37 17.88,19.13 v19.68,19.13 | U2.2 24.26,17.98 v24.26,19.16 | 28.25,19.61 v28.25,20.42 | v29.92,29.16 29.82,29.16 29.08,28.42 28.42,28.42 ENC.2 | U2.8 25.38,21.77 v26.42,20.73 | v19.96,24.08 19.96,23.18 C24.2 | EXT.2 5.95,27.54 6.81,28.4 v6.81,28.65
  other vias: 9.19,20.98 9.19,23.01 11.23,18.95 9.19,18.95 11.23,20.98 1.37,15.19 1.37,14.63 0.91,11.89 1.52,11.89 2.13,11.89 3.07,11.89 3.68,11.89 4.29,11.89 5.23,11.89 5.84,11.89 6.45,11.89 1.22,11.38 1.83,11.38 0.91,10.87 1.52,10.87 2.13,10.87 3.33,11.38 3.94,11.38 3.07,10.87 3.68,10.87 4.29,10.87 5.54,11.38 6.15,11.38 6.45,10.87 5.84,10.87 5.23,10.87 7.52,12.14 8.13,12.14 8.74,12.14 8.43,11.63 7.82,11.63 7.52,11.13 8.13,11.13 8.74,11.13 11.79,13.11 12.4,13.11 13,13.11 13.61,13.11 11.94,12.6 12.55,12.6 13.16,12.6 13.77,12.6 11.79,12.05 12.38,12.05 12.99,12.05 13.61,12.05 15.14,13.11 15.75,13.11 16.36,13.11 16.97,13.11 15.29,12.6 15.9,12.6 16.51,12.6 17.07,12.6 15.14,12.04 15.75,12.04 16.36,12.04 30.07,5.44 30.38,5.94 30.68,5.44 31.29,5.44 33.48,4.93 30.43,4.93 31.04,4.93 31.65,4.93 32.26,4.93 32.87,4.93 30.23,4.37 30.78,4.42 30.07,3.81 33.22,4.42 31.39,4.42 32,4.42 32.61,4.42 31.04,12.85 30.73,12.34 31.04,11.84 19,13 19.61,13 20.22,13 19.96,12.5 19.25,12.5 19,11.99 19.61,11.99 20.22,11.99 21.59,13.26 22.2,13.26 22.81,13.26 22.5,12.75 21.89,12.75 21.59,12.24 22.2,12.24 22.81,12.24 23.83,13.26 24.43,13.26 24.74,12.75 24.13,12.75 23.83,12.24 24.43,12.24 25.04,12.24 27.08,12.85 27.69,12.85 28.3,12.85 27.99,12.34 27.38,12.34 27.08,11.84 27.69,11.84 28.3,11.84 29.21,12.85 29.82,12.85 30.43,12.85 30.12,12.34 29.51,12.34 29.21,11.84 29.82,11.84 30.43,11.84 16.97,12.04 2.44,11.38 0.61,11.38 4.52,11.38 28.6,12.34 31.34,12.34 23.52,12.75 31.65,12.85 0.91,9.75 1.47,9.75 2.08,9.75 1.22,9.19 1.78,9.19 3.1,9.75 3.71,9.75 4.32,9.75 3.4,9.19 4.01,9.19 5.23,9.75 5.84,9.75 6.45,9.75 5.54,9.19 6.15,9.19 11.84,11.07 12.45,11.07 13.67,11.07 13.06,11.07 13.41,10.57 15.19,11.07 15.8,11.07 16.41,11.07 17.02,11.07 15.49,10.57 16.71,10.57 12.14,10.57 19,11.02 19.61,11.02 20.22,11.02 21.59,11.23 22.2,11.23 22.81,11.23 23.77,11.23 24.38,11.23 24.99,11.23 29.16,10.72 29.77,10.72 30.38,10.72 6.81,29.26 29.77,5.94
  pour Top (no thermals): 1.27,17.53 2.29,17.53 2.29,15.65 1.83,15.19 1.83,14.22 2.39,13.67 1.7,12.98 0.81,13.87 0.81,17.07
  pour Bottom (no thermals): 6.76,23.52 11.58,23.52 11.73,23.37 11.73,18.54 11.63,18.44 6.81,18.44 6.65,18.59 6.65,23.42
  pour Route15 (no thermals): 33.83,13.97 26.87,13.97 25.35,15.49 7.87,15.49 6.5,14.12 0.15,14.12 0,14.27 0,31.7 0.3,32 33.83,32 33.99,31.85 33.99,14.12
  pour Top (no thermals): 0.2,12.45 6.25,12.45 6.45,12.65 6.45,13.16 6.6,13.31 8.99,13.31 9.14,13.16 9.14,9.91 9.09,9.86 7.11,9.86 6.82,9.56 6.82,8.7 6.76,8.64 0.25,8.64 0.05,8.84 0.05,12.29
  pour Top (no thermals): 11.44,9.84 11.44,13.42 11.63,13.61 13.92,13.61 14.1,13.44 14.1,9.87 14.07,9.84
  pour Top (no thermals): 14.78,9.84 14.78,13.41 14.88,13.51 17.32,13.51 17.42,13.41 17.42,9.84
  pour Top (no thermals): 21.18,10.31 21.18,13.56 21.29,13.67 25.3,13.67 25.4,13.56 25.4,10.31 25.3,10.21 21.29,10.21
  pour Top (no thermals): 18.64,13.31 18.78,13.45 20.43,13.45 20.59,13.3 20.59,9.97 20.57,9.96 18.64,9.96
  pour Top (no thermals): 27.18,5.59 27.18,6.2 27.08,6.3 27.08,6.35 27.18,6.45 30.73,6.45 31.9,5.28 33.68,5.28 33.93,5.03 33.93,4.27 33.73,4.06 31.04,4.06 30.48,3.51 30.48,3.4 30.33,3.25 29.77,3.25 29.62,3.4 29.62,4.06 29.82,4.27 29.82,5.28 29.51,5.59
  pour Top (no thermals): 26.67,9.86 26.67,13.46 33.58,13.46 33.93,13.11 33.93,10.01 33.73,9.8 26.72,9.8
  pour Route2 (no thermals): 0.05,13.41 0.25,13.61 8.53,13.61 9.35,14.43 26.21,14.43 26.97,13.67 33.73,13.67 33.93,13.46 33.93,0.41 33.58,0.05 29.92,0.05 29.72,0.25 29.72,4.22 29.97,4.47 29.97,5.33 29.57,5.74 26.21,5.74 25.91,6.05 25.91,9.04 24.99,9.96 7.98,9.96 6.65,8.64 0.2,8.64 0.05,8.79
  pour Route15 (no thermals): 0.05,13.41 0.2,13.56 8.43,13.56 9.7,14.83 25.15,14.83 26.47,13.51 33.78,13.51 33.98,13.31 33.98,10.08 33.68,9.91 7.72,9.91 6.45,8.64 0.25,8.64 0.05,8.84
  pour Bottom (no thermals): 0.25,8.64 0.05,8.84 0.05,12.6 0.2,12.75 8.08,12.75 8.94,13.61 14.78,13.61 15.7,14.53 26.47,14.53 27.23,13.77 33.53,13.77 33.93,13.36 33.93,10.01 33.73,9.8 7.06,9.8 6.76,9.5 6.76,8.74 6.65,8.64
  pour Bottom (no thermals): 29.36,6.45 30.73,6.45 30.94,6.25 31.9,5.28 33.68,5.28 33.93,5.03 33.93,4.98 33.93,4.27 33.73,4.06 31.04,4.06 30.48,3.51 30.48,3.4 30.33,3.25 29.77,3.25 29.62,3.4 29.62,4.06 29.82,4.27 29.82,5.28 29.51,5.59 29.21,5.89 29.21,6.3
  pour Bottom (no thermals): 6.45,28.45 6.45,29.51 6.55,29.62 7.11,29.62 7.26,29.46 7.26,28.4 7.06,28.19 6.71,28.19
  pour Bottom (no thermals): 0.86,14.38 0.86,15.44 1.07,15.65 1.68,15.65 1.88,15.44 1.88,14.38 1.68,14.17 1.07,14.17
HH1  (via drill 2 pad 3.5)
  other vias: 17,30
HH2  (via drill 2 pad 3.5)
  other vias: 1.95,2
HH3  (via drill 2 pad 3.5)
  other vias: 32.05,2
I_A  (via drill 0.3)
  Top 0.203: U1.8 28.43,22.33 28.09,22 v27.13,22 | v15.04,24.49 14.43,25.09 13.06,25.09 12.39,24.43 DRV1.25
  Bottom 0.203: v15.04,24.49 15.24,24.69 18.69,24.69 19.96,25.96 25.55,25.96 25.96,25.55 25.96,24.48 26.31,24.12 26.31,22.5 26.82,22 v27.13,22
I_B  (via drill 0.3)
  Top 0.203: U1.9 29.08,22.83 29.01,22.76 v27.84,22.76 | v14.02,24.49 13.06,24.49 12.65,24.08 DRV1.24
  Bottom 0.203: v27.84,22.76 26.92,22.76 26.67,23.01 26.67,24.27 26.31,24.63 26.31,25.7 25.7,26.31 19.81,26.31 18.59,25.09 14.63,25.09 v14.02,24.49
INDICATOR
  Top 0.203: U1.25 23.65,28.93 23.86,29.14 24.26,29.14 24.88,29.77 R22.2
MISO  (via drill 0.3)
  Top 0.203: v26.72,26.62 27.33,26.62 28.02,25.93 28.02,24.46 23.01,19.45 23.01,18.9 21.65,17.54 U1.52
  Bottom 0.203: ENC.4 27.66,26.27 27.31,26.61 v26.73,26.61 v26.72,26.62
MOSI  (via drill 0.3)
  Top 0.203: U1.53 22.15,17.48 23.42,18.75 23.42,19.3 28.45,24.33 28.45,26.36 29.06,26.98 v29.57,26.98
  Bottom 0.203: ENC.3 28.28,27.28 29.26,27.28 v29.57,26.98
N$1
  Top 0.152: D2.1 13.77,27.9 R5.1
N$2
  Top 0.203: U1.13 30.81,24.83 CHOKE.2 31.39,25.05 C41.1
N$3
  Top 0.203: U1.30 21.15,28.87 21.46,29.18 21.84,29.18 22.3,29.8 22.34,29.8 C9.2
N$5
  Top 0.152: R6.1 9.96,14.97 9.96,7.26 10.48,6.74 10.48,4.23 9.88,3.63 Q7.4
N$7
  Top 0.152: Q8.4 11.11,6.24 11.11,7.09 10.57,7.63 10.57,14.18 10.79,14.41 10.79,14.51 R7.1
N$8
  Top 0.152: R10.1 14.99,15.34 15.49,14.83 17.95,14.83 18.94,13.84 20.75,13.84 20.88,13.72 20.88,7.12 21.03,6.96 21.69,6.96 21.89,6.76 21.89,4.22 21.51,3.84 21.2,3.84 Q9.4
N$10
  Top 0.152: Q10.4 14.44,6.66 14.44,13.6 13.1,14.95 R11.1
N$11
  Top 0.152: Q11.4 25.71,4.59 25.71,13.86 25.45,14.12 19.06,14.12 18.04,15.14 16.34,15.14 15.68,15.81 15.68,20.08 R12.1
N$12
  Top 0.152: R13.1 15.65,22 16.31,21.34 16.31,16.15 16.71,15.75 18.35,15.75 19.37,14.73 25.86,14.73 26.32,14.28 26.32,6.26 26.71,5.87 Q12.4
N$14
  Top 0.203: U1.60 25.65,16.26 26.11,15.8 26.11,15.59 26.54,15.17 28.28,15.17 R14.2
N$24
  Top 0.203: U1.14 30.26,25.33 30.43,25.5 31.6,25.5 31.8,25.7 32.92,25.7 33.17,25.45 33.17,17.01 30.74,14.58 R26.1
  Top 0.305: R27.2 R26.1
N$28
  Top 0.203: D3.1 30.84,30.77 26.55,30.77 26.47,30.69 R22.1
NRST  (via drill 0.3)
  Top 0.203: R15.1 30.54,22.06 30.31,21.83 U1.7 28.84,21.83 v28.55,21.54
  Bottom 0.152: PROG.5 15.97,21.37 16.87,20.47 20.83,20.47 22.2,21.84 22.2,25.4 22.4,25.6 25.4,25.6 25.58,25.42 25.58,24.41 25.96,24.03 25.96,22.1 26.67,21.39 28.4,21.39 v28.55,21.54
PH0
  Top 0.203: U1.5 30.27,20.83 30.48,20.62 30.48,18.8 30.71,18.56 XT1.1
PH1
  Top 0.203: U1.6 30.62,21.33 30.99,20.96 XT1.3
PHASA  (via drill 0.35)
  Top 0.152: Q8.11 10.79,4.71 10.79,6.92 10.26,7.45 10.26,14.4 10.49,14.63 10.49,17.48 DRV1.9
  other vias: 11.53,4.42 12.04,4.42 12.6,4.42 13.16,4.42 11.48,3.91 12.04,3.91 12.6,3.91 13.72,4.42 11.48,3.4 12.04,3.4 13.16,3.91 13.72,3.91 12.6,3.4 13.16,3.4 13.72,3.4 6.76,2.13 7.37,2.13 7.98,2.13 6.15,2.13 6.45,1.63 7.06,1.63 7.67,1.63 8.28,1.63 6.15,1.12 6.76,1.12 7.37,1.12 7.98,1.12
  pour Top (no thermals): 9.04,3.86 7.21,3.86 6.6,3.25 4.67,3.25 4.42,3 4.42,0.46 4.83,0.05 13,0.05 13.41,0.46 13.41,2.34 14.07,3 14.07,4.98 13.77,5.28 11.43,5.28 11.18,5.03 11.18,3.56 10.72,3.1 9.25,3.1 9.09,3.25 9.09,3.81
  pour Route2 (no thermals): 4.37,2.95 4.72,3.3 6.65,3.3 7.11,3.76 10.67,3.76 11.02,4.11 11.02,4.42 11.38,4.78 13.87,4.78 14.07,4.57 14.07,3.2 13.41,2.54 13.41,0.25 13.21,0.05 4.57,0.05 4.37,0.25
PHASB  (via drill 0.35)
  Top 0.152: Q10.9 18.03,4.78 18.03,8.94 18.34,9.25 18.34,13.92 17.73,14.53 15.14,14.53 14.22,15.44 14.22,18.29 14.53,18.59 14.53,19.25 14.21,19.57 13.26,19.57 13.17,19.66 12.72,19.66 DRV1.16
  other vias: 15.09,4.42 15.65,4.42 16.21,4.42 16.71,4.42 15.09,3.91 15.65,3.91 16.21,3.91 17.22,4.42 15.09,3.4 15.65,3.4 16.76,3.91 17.32,3.91 16.21,3.4 16.76,3.4 17.32,3.4 20.62,1.22 20.88,1.73 14.48,1.22 15.09,1.22 19.05,1.73 19.66,1.73 20.27,1.73 14.78,0.71 15.39,0.71 18.8,1.22 19.41,1.22 20.02,1.22
  pour Top (no thermals): 17.48,5.28 14.83,5.28 14.63,5.08 14.63,2.9 14.07,2.34 14.07,0.46 14.48,0.05 20.83,0.05 21.29,0.51 21.29,2.79 20.93,3.15 20.57,3.15 20.52,3.2 20.52,3.81 20.47,3.86 18.19,3.86 17.83,4.22 17.83,4.57 17.78,4.62 17.68,4.62 17.48,4.83
  pour Route2 (no thermals): 14.07,0.25 14.07,2.44 14.58,2.95 14.58,4.47 14.88,4.78 17.78,4.78 18.03,4.52 18.03,4.32 18.54,3.81 20.83,3.81 21.29,3.35 21.29,0.3 21.03,0.05 14.27,0.05
PHASC  (via drill 0.35)
  Top 0.152: DRV1.19 12.7,21.29 15.62,21.29 16,20.9 16,15.98 16.54,15.44 18.2,15.44 19.21,14.43 25.66,14.43 26.01,14.07 26.01,4.62 26.22,4.42 Q12.11
  other vias: 29.21,4.98 27.23,4.47 27.79,4.47 28.35,4.47 26.67,3.91 27.23,3.91 27.79,3.91 28.91,4.47 26.67,3.4 27.23,3.4 28.35,3.91 28.91,3.91 27.79,3.4 28.35,3.4 28.91,3.4 26.92,4.98 27.48,4.98 28.09,4.98 28.65,4.98 26.06,1.78 26.67,1.78 27.28,1.78 27.89,1.78 26.37,1.27 26.97,1.27 27.58,1.27 28.19,1.27 26.06,0.76 26.67,0.76 27.28,0.76 27.89,0.76
  pour Top (no thermals): 24.28,3.86 22.5,3.86 21.84,3.2 21.84,0.51 22.3,0.05 28.85,0.05 29.31,0.51 29.31,4.22 29.51,4.42 29.51,5.13 29.36,5.28 26.67,5.28 26.37,4.98 26.37,3.71 25.76,3.1 24.38,3.1 24.28,3.2
  pour Route2 (no thermals): 21.84,0.25 21.84,3.3 22.35,3.81 25.55,3.81 25.96,4.22 25.96,4.98 26.26,5.28 29.36,5.28 29.51,5.13 29.51,4.62 29.26,4.37 29.26,0.05 22.05,0.05
PWMA  (via drill 0.3)
  Top 0.152: DRV1.41 4.84,21.74 v4.59,21.49 | v17.22,21.34 U1.43
  Bottom 0.14: v17.22,21.34 16.99,21.34 16.45,21.87 14.35,21.87
  Bottom 0.152: v4.59,21.49 6.25,23.15 6.25,23.62 6.66,24.03 9.1,24.03 10.6,25.52 12.54,25.52 12.7,25.37 12.7,23.52 14.35,21.87
PWMB  (via drill 0.3)
  Top 0.152: DRV1.39 4.62,22.73 v4.61,22.72 | v16.76,22.86 16.76,22.61 17.5,21.87 18.11,21.87 U1.42
  Bottom 0.14: v16.76,22.86 16.75,22.87 14.01,22.87
  Bottom 0.152: v4.61,22.72 5.34,22.72 5.94,23.32 5.94,23.8 6.48,24.33 8.97,24.33 10.47,25.83 12.67,25.83 13.01,25.5 13.01,23.88 14.01,22.87
PWMC  (via drill 0.3)
  Top 0.152: DRV1.37 v5.74,24.43 | v16.76,24.08 17.37,23.47 17.37,22.54 17.55,22.37 18.11,22.37 U1.41
  Bottom 0.152: v5.74,24.43 5.94,24.64 8.85,24.64 10.35,26.13 12.8,26.13 13.31,25.62 13.31,24.23 13.64,23.9 16.59,23.9 v16.76,24.08
SCK  (via drill 0.3)
  Top 0.203: v26.96,25.78 27.14,25.78 27.59,25.33 27.59,24.58 22.61,19.6 22.61,19.1 21.15,17.64 U1.51
  Bottom 0.203: ENC.5 27.65,25.27 27.14,25.78 v26.96,25.78
SPA  (via drill 0.35)
  Top 0.152: R8.2 12.75,8.84 12.55,9.04 11.2,9.04 10.87,9.37 10.87,13.97 11.18,14.28 11.73,14.28 11.89,14.43 11.89,16.71 11.76,16.84 11.59,16.84 11.46,16.97 DRV1.11
  other vias: 11.79,8.28 12.4,8.28 13.72,8.28 13.16,8.28 12.19,7.77 12.8,7.77 13.46,7.77 11.58,7.77
  pour Top (no thermals): 11.07,8.59 11.14,8.65 14.07,8.65 14.07,5.94 13.72,5.59 12.04,5.59 11.99,5.64 11.99,6.2 11.89,6.3 11.68,6.3 11.43,6.55 11.43,7.32 11.07,7.67
  pour Bottom (no thermals): 10.97,9.14 10.97,7.72 11.33,7.37 13.92,7.37 14.22,7.67 14.22,9.19 14.07,9.35 11.18,9.35
SPB  (via drill 0.35)
  Top 0.152: R9.2 16.1,8.84 16.31,9.04 17.58,9.04 18.03,9.5 18.03,13.78 17.59,14.22 14.94,14.22 13.92,15.24 13.92,17.88 13.16,18.64 12.72,18.64 DRV1.14
  other vias: 15.14,8.28 15.75,8.28 16.46,8.28 17.07,8.28 15.44,7.72 16.05,7.72 16.66,7.72 17.22,7.72
  pour Top (no thermals): 14.78,8.65 17.56,8.65 17.68,8.53 17.68,5.84 17.42,5.59 15.8,5.59 15.75,5.64 15.75,6.2 15.6,6.35 15.34,6.35 14.78,6.91
  pour Bottom (no thermals): 14.68,9.19 14.83,9.35 17.58,9.35 17.73,9.19 17.73,7.67 17.42,7.37 14.99,7.37 14.68,7.67
SPI-MISO  (via drill 0.3)
  Top 0.152: DRV1.29 9.96,25.51 9.8,25.66 9.8,26.22 R3.1 9.45,26.48 8.67,27.25 v8.53,27.25 | U1.22 25.15,27.74 24.35,26.95 23.73,26.95 v23.71,26.92
  Bottom 0.152: v23.71,26.92 23.71,26.93 22.45,28.19 19.89,28.19 18.04,26.34 14.32,26.34 13.28,27.38 9.22,27.38 9.09,27.25 v8.53,27.25
SPI-MOSI  (via drill 0.3)
  Top 0.152: DRV1.30 9.45,24.99 8.53,25.91 v8.53,26.36 | v22.81,26.92 23.42,27.53 24.47,27.53 24.65,27.71 U1.23
  Bottom 0.152: v22.81,26.92 22.81,26.94 21.86,27.89 20.02,27.89 18.16,26.04 14.2,26.04 13.16,27.08 9.99,27.08 9.28,26.36 v8.53,26.36
SPI-NSS-DRV  (via drill 0.3)
  Top 0.152: v7.32,26.26 7.32,26.16 8.43,25.05 DRV1.32 | U1.20 26.15,27.83 24.13,25.81 22.2,25.81 v21.08,26.92
  Bottom 0.152: v21.08,26.92 19.91,26.92 18.41,25.43 13.95,25.43 12.9,26.47 10.25,26.47 9.06,25.28 7.94,25.28 7.32,25.91 v7.32,26.26
SPI-SCK  (via drill 0.3)
  Top 0.152: v7.61,27.11 7.92,26.8 7.92,26.04 8.94,25.02 DRV1.31 | U1.21 25.65,27.81 23.95,26.11 22.75,26.11 v21.94,26.92
  Bottom 0.152: v21.94,26.92 21.28,27.58 20.14,27.58 18.29,25.73 14.07,25.73 13.03,26.77 10.12,26.77 8.98,25.64 8.23,25.64 7.92,25.94 7.92,26.8 v7.61,27.11
SW
  Top 0.254: DRV1.45 5.21,19.74 4.72,19.25 4.06,19.25 | 4.06,19.25 C4.1 | 4.06,19.25 3.3,19.25 3.2,19.36 3.2,20.42 2.18,21.44 D1.C
  Top 0.61: D1.C 2.18,23.94 2.49,24.25 L1.2
TCK  (via drill 0.35)
  Top 0.203: v20.3,18.45 20.16,18.31 U1.49
  Bottom 0.203: PROG.2 15.5,18.45 v20.3,18.45
TMS  (via drill 0.3)
  Top 0.203: v20.37,19.81 20.35,19.83 U1.46
  Bottom 0.152: v20.37,19.81 20.32,19.86 16.87,19.86 16.36,20.37 PROG.4
USART_RX  (via drill 0.3)
  Top 0.152: U1.17 27.65,27.7 27.48,27.53 26.29,27.53 24.26,25.5 21.13,25.5 20.93,25.3 v20.52,25.3
  Bottom 0.152: PROG.7 15.52,23.47 17.99,23.47 19.81,25.3 v20.52,25.3
USART_TX  (via drill 0.3)
  Top 0.152: U1.16 30.01,26.33 30.18,26.5 30.18,27.38 29.97,27.58 28.96,27.58 28.6,27.23 26.42,27.23 24.38,25.19 21.92,25.19 v21.53,24.8
  Bottom 0.152: PROG.6 15.54,22.25 17.25,22.25 19.68,24.69 21.42,24.69 v21.53,24.8
VCP
  Top 0.254: DRV1.5 8.43,16.76 8.28,16.61 8.28,16.37 8.13,16.22 C6.2

### Text on the board
tPlace: ( ^ω^) | 03/30 Rev_2 | BLDC Drv_4 / Shuang | G | 24 | U | V | W
bPlace: 2mm | 3V3 / G / MOSI | EXT1 / EXT2 / G / 5V | MISO / SCK / CS | L | H | BLDC_Sub_Driver / PROJ_AC / Rev_2_03/30 | G / H / L | RX / TX / NRST / TMS / G / TCK / 3V3 | G | 24 | U | V | W